# EAGLE design board (EAGLE 6.4)
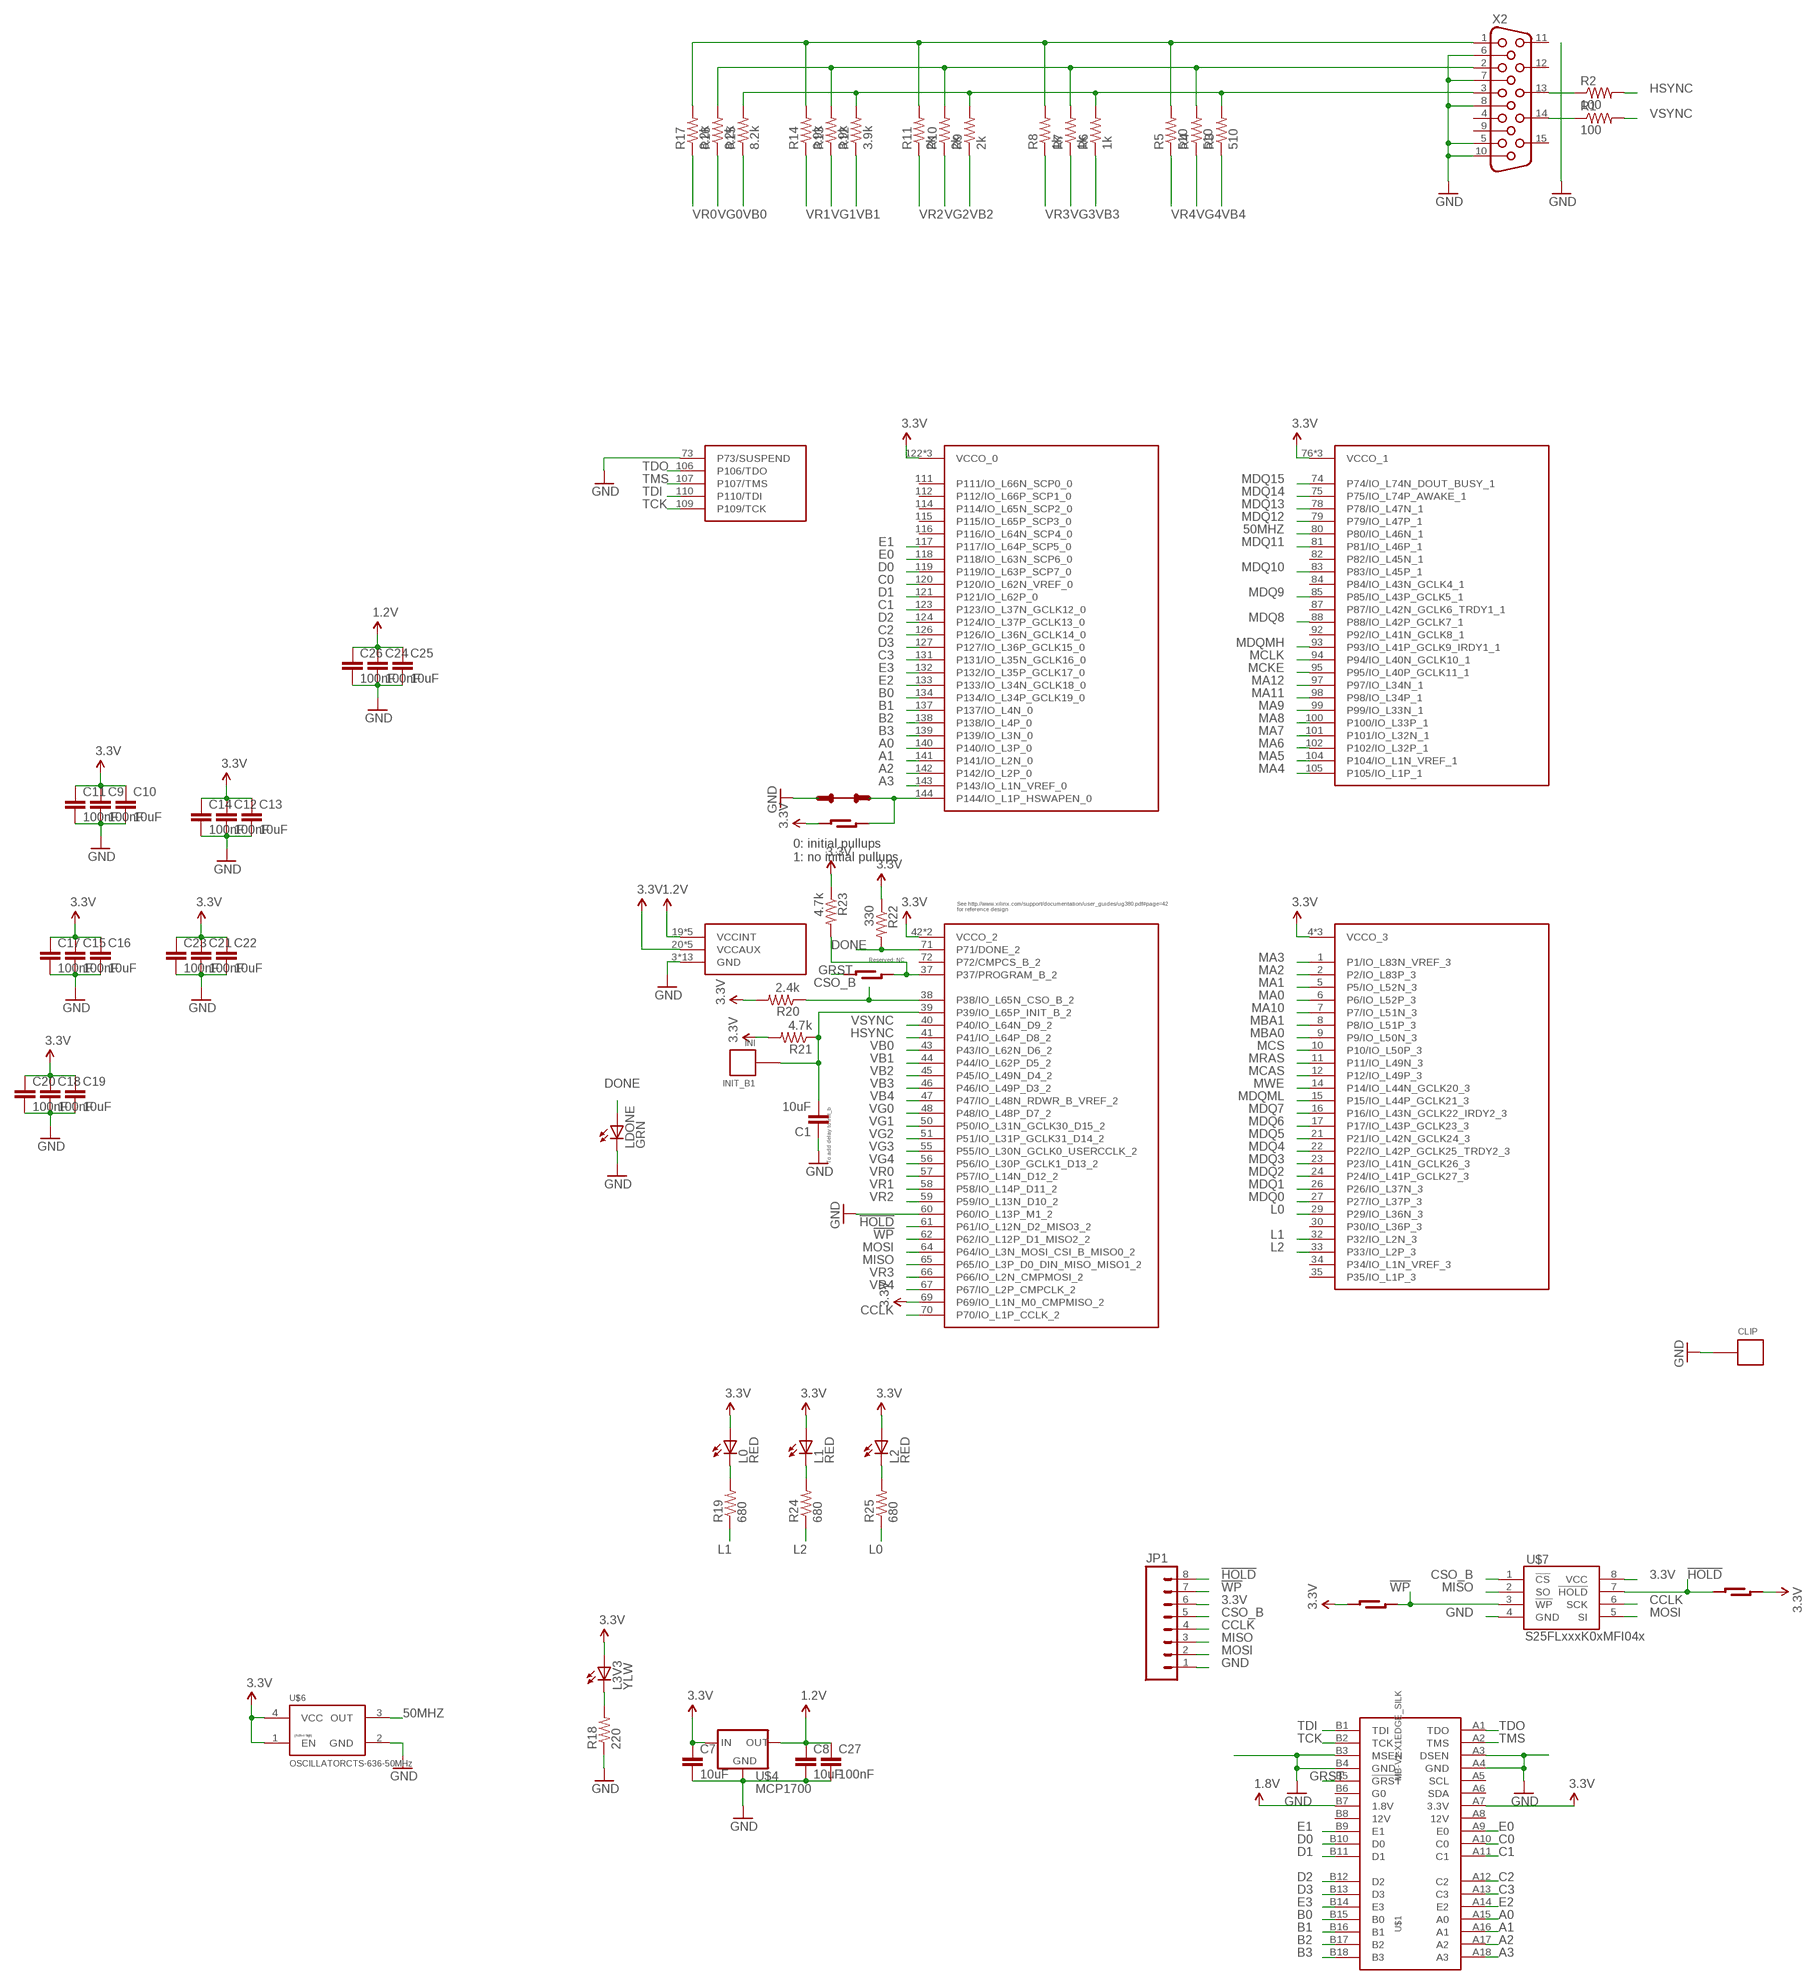
[diagram p0: schematic, sheet 1, part 1 of 2]
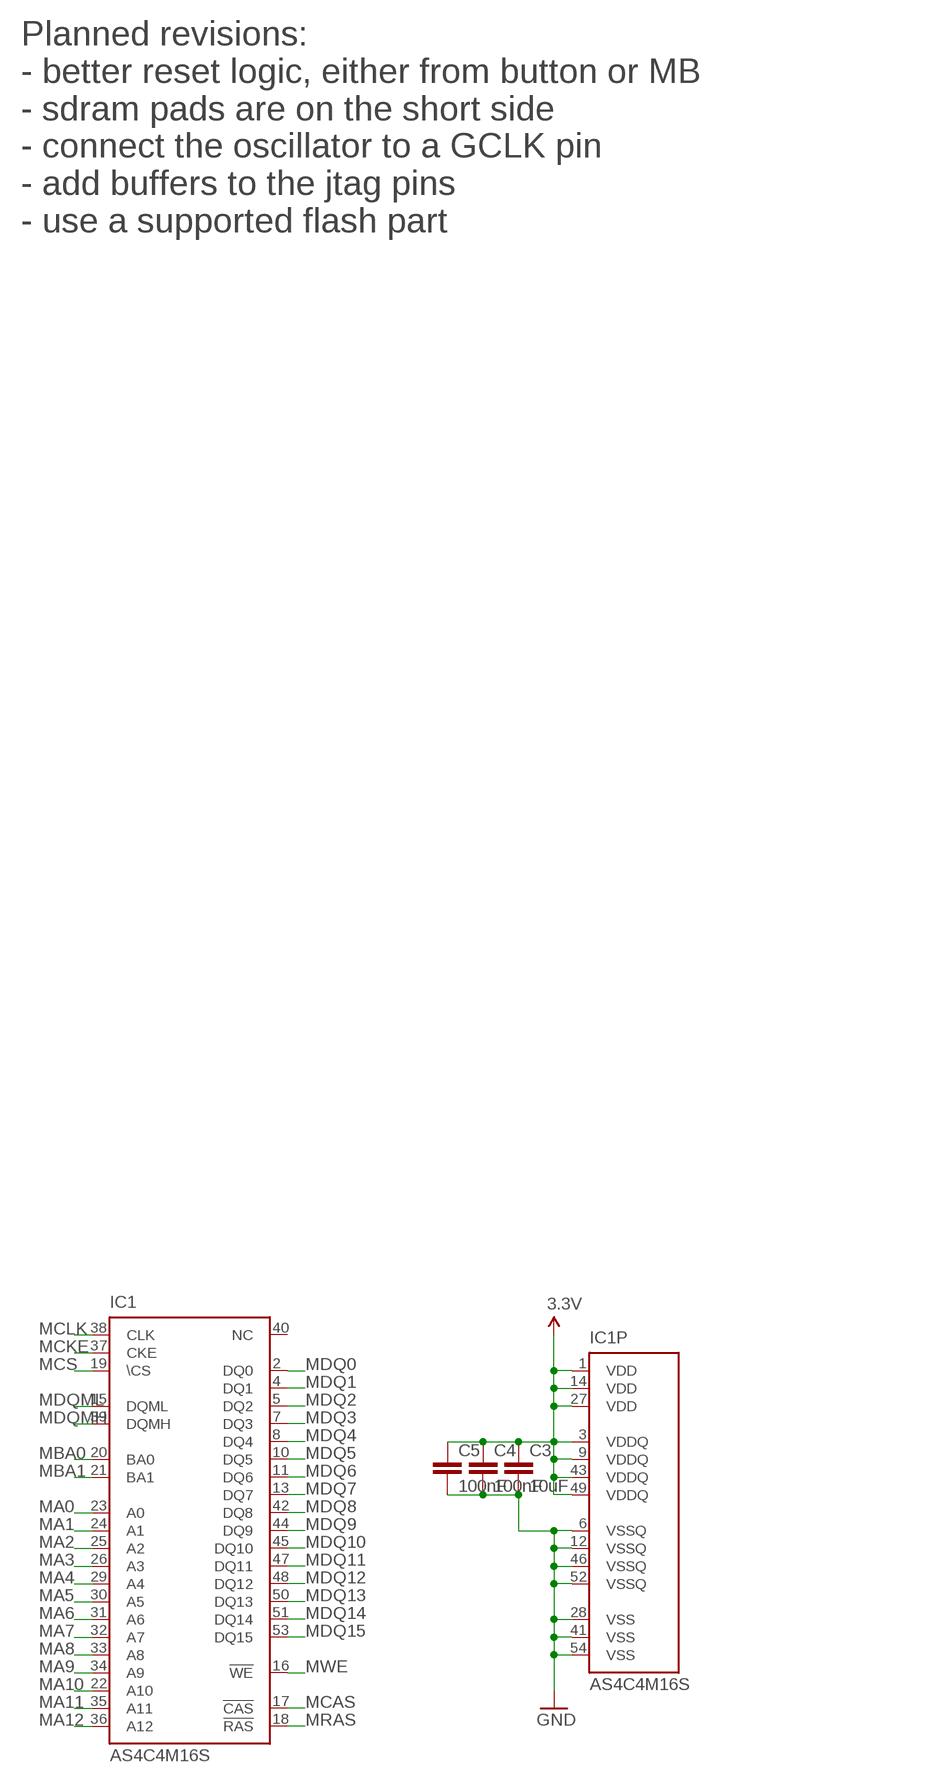
[diagram p1: schematic, sheet 1, part 2 of 2]

## Parts
C1  10uF  CAP0805  [0805]
C3  10uF  CAP0805  [0805]
C4  100nF  CAP0402-CAP  [0402-CAP]
C5  100nF  CAP0402-CAP  [0402-CAP]
C7  10uF  CAP0805  [0805]
C8  10uF  CAP0805  [0805]
C9  100nF  CAP0402-CAP  [0402-CAP]
C10  10uF  CAP0805  [0805]
C11  100nF  CAP0402-CAP  [0402-CAP]
C12  100nF  CAP0402-CAP  [0402-CAP]
C13  10uF  CAP0805  [0805]
C14  100nF  CAP0402-CAP  [0402-CAP]
C15  100nF  CAP0402-CAP  [0402-CAP]
C16  10uF  CAP0805  [0805]
C17  100nF  CAP0402-CAP  [0402-CAP]
C18  100nF  CAP0402-CAP  [0402-CAP]
C19  10uF  CAP0805  [0805]
C20  100nF  CAP0402-CAP  [0402-CAP]
C21  100nF  CAP0402-CAP  [0402-CAP]
C22  10uF  CAP0805  [0805]
C23  100nF  CAP0402-CAP  [0402-CAP]
C24  100nF  CAP0402-CAP  [0402-CAP]
C25  10uF  CAP0805  [0805]
C26  100nF  CAP0402-CAP  [0402-CAP]
C27  100nF  CAP0402-CAP  [0402-CAP]
CLIP  CONNECTORCLIP  [CLIP-AREA]
IC1  AS4C4M16S  MT48LC64M4A2  [TSOP54-400]
INIT_B1  INI  CONNECTOR1.27  [TESTPAD-1.27]
JP1  M08LOCK  [1X08_LOCK]
L0  RED  LED0603  [0603_LED]
L1  RED  LED0603  [0603_LED]
L2  RED  LED0603  [0603_LED]
L3V3  YLW  LED0603  [0603_LED]
LDONE  GRN  LED0603  [0603_LED]
R1  100  RESISTOR0603  [0603-RES]
R2  100  RESISTOR0603  [0603-RES]
R3  510  RESISTOR0603  [0603-RES]
R4  510  RESISTOR0603  [0603-RES]
R5  510  RESISTOR0603  [0603-RES]
R6  1k  RESISTOR0603  [0603-RES]
R7  1k  RESISTOR0603  [0603-RES]
R8  1k  RESISTOR0603  [0603-RES]
R9  2k  RESISTOR0603  [0603-RES]
R10  2k  RESISTOR0603  [0603-RES]
R11  2k  RESISTOR0603  [0603-RES]
R12  3.9k  RESISTOR0603  [0603-RES]
R13  3.9k  RESISTOR0603  [0603-RES]
R14  3.9k  RESISTOR0603  [0603-RES]
R15  8.2k  RESISTOR0603  [0603-RES]
R16  8.2k  RESISTOR0603  [0603-RES]
R17  8.2k  RESISTOR0603  [0603-RES]
R18  220  RESISTOR0603  [0603-RES]
R19  680  RESISTOR0603  [0603-RES]
R20  2.4k  RESISTOR0603  [0603-RES]
R21  4.7k  RESISTOR0603  [0603-RES]
R22  330  RESISTOR0603  [0603-RES]
R23  4.7k  RESISTOR0603  [0603-RES]
R24  680  RESISTOR0603  [0603-RES]
R25  680  RESISTOR0603  [0603-RES]
SB1  SOLDER-BRIDGEOPEN  [SOLDER-BRIDGE-OPEN]
SB2  TRACE-CUT  [TRACE-CUT]
SB3  SOLDER-BRIDGEOPEN  [SOLDER-BRIDGE-OPEN]
SB4  SOLDER-BRIDGEOPEN  [SOLDER-BRIDGE-OPEN]
SB5  SOLDER-BRIDGEOPEN  [SOLDER-BRIDGE-OPEN]
U$1  MB-V1-X1EDGE_SILK  [MB-V1-X1-EDGE]
U$4  MCP1700  VREGSOT23-3  [SOT23-3]
U$6  OSCILLATORCTS-636-50MHz  OSCILLATORCTS-636  [CTS-636]
U$7  S25FLxxxK0xMFI04x  S25FL  [SO08]
U$9  XC6SLX-TQ144  [XILINX_TQ144]
X2  HF15H  [HDF15H]

## Nets
1.2V: C8.1 C24.1 C25.1 C26.1 C27.1 U$4.2(OUT) U$9.19(VCCINT) U$9.28(VCCINT) U$9.52(VCCINT) U$9.89(VCCINT) U$9.128(VCCINT)
1.8V: U$1.B7(1.8V)
3.3V: C3.1 C4.1 C5.1 C7.1 C9.1 C10.1 C11.1 C12.1 C13.1 C14.1 C15.1 C16.1 C17.1 C18.1 C19.1 C20.1 C21.1 C22.1 C23.1 IC1.1(VDD) IC1.3(VDDQ) IC1.9(VDDQ) IC1.14(VDD) IC1.27(VDD) IC1.43(VDDQ) IC1.49(VDDQ) JP1.6 L0.A L1.A L2.A L3V3.A R20.2 R21.2 R22.1 R23.1 SB1.R1 SB1.R2 SB3.L1 SB3.L2 SB4.R1 SB4.R2 U$1.A7(3.3V) U$4.3(IN) U$6.1(EN) U$6.4(VCC) U$7.8(VCC) U$9.4(VCCO_3) U$9.18(VCCO_3) U$9.20(VCCAUX) U$9.31(VCCO_3) U$9.36(VCCAUX) U$9.42(VCCO_2) U$9.53(VCCAUX) U$9.63(VCCO_2) U$9.69(P69/IO_L1N_M0_CMPMISO_2) U$9.76(VCCO_1) U$9.86(VCCO_1) U$9.90(VCCAUX) U$9.103(VCCO_1) U$9.122(VCCO_0) U$9.125(VCCO_0) U$9.129(VCCAUX) U$9.135(VCCO_0)
50MHZ: U$6.3(OUT) U$9.80(P80/IO_L46N_1)
!HOLD: JP1.8 SB3.R1 SB3.R2 U$7.7(!HOLD) U$9.61(P61/IO_L12N_D2_MISO3_2)
!WP: JP1.7 SB4.L1 SB4.L2 U$7.3(!WP) U$9.62(P62/IO_L12P_D1_MISO2_2)
A0: U$1.A15(A0) U$9.140(P140/IO_L3P_0)
A1: U$1.A16(A1) U$9.141(P141/IO_L2N_0)
A2: U$1.A17(A2) U$9.142(P142/IO_L2P_0)
A3: U$1.A18(A3) U$9.143(P143/IO_L1N_VREF_0)
B0: U$1.B15(B0) U$9.134(P134/IO_L34P_GCLK19_0)
B1: U$1.B16(B1) U$9.137(P137/IO_L4N_0)
B2: U$1.B17(B2) U$9.138(P138/IO_L4P_0)
B3: U$1.B18(B3) U$9.139(P139/IO_L3N_0)
C0: U$1.A10(C0) U$9.120(P120/IO_L62N_VREF_0)
C1: U$1.A11(C1) U$9.123(P123/IO_L37N_GCLK12_0)
C2: U$1.A12(C2) U$9.126(P126/IO_L36N_GCLK14_0)
C3: U$1.A13(C3) U$9.131(P131/IO_L35N_GCLK16_0)
CCLK: JP1.4 U$7.6(SCK) U$9.70(P70/IO_L1P_CCLK_2)
CSO_B: JP1.5 R20.1 U$7.1(!CS) U$9.38(P38/IO_L65N_CSO_B_2)
D0: U$1.B10(D0) U$9.119(P119/IO_L63P_SCP7_0)
D1: U$1.B11(D1) U$9.121(P121/IO_L62P_0)
D2: U$1.B12(D2) U$9.124(P124/IO_L37P_GCLK13_0)
D3: U$1.B13(D3) U$9.127(P127/IO_L36P_GCLK15_0)
DONE: LDONE.A R22.2 U$9.71(P71/DONE_2)
E0: U$1.A9(E0) U$9.118(P118/IO_L63N_SCP6_0)
E1: U$1.B9(E1) U$9.117(P117/IO_L64P_SCP5_0)
E2: U$1.A14(E2) U$9.133(P133/IO_L34N_GCLK18_0)
E3: U$1.B14(E3) U$9.132(P132/IO_L35P_GCLK17_0)
GND: C1.1 C3.2 C4.2 C5.2 C7.2 C8.2 C9.2 C10.2 C11.2 C12.2 C13.2 C14.2 C15.2 C16.2 C17.2 C18.2 C19.2 C20.2 C21.2 C22.2 C23.2 C24.2 C25.2 C26.2 C27.2 CLIP.P$1(P) CLIP.P$2(P) IC1.6(VSSQ) IC1.12(VSSQ) IC1.28(VSS) IC1.41(VSS) IC1.46(VSSQ) IC1.52(VSSQ) IC1.54(VSS) JP1.1 LDONE.C R18.1 SB2.L1 U$1.A3(DSEN) U$1.A4(GND) U$1.B3(MSEN) U$1.B4(GND) U$4.1(GND) U$6.2(GND) U$7.4(GND) U$9.3(GND) U$9.13(GND) U$9.25(GND) U$9.49(GND) U$9.54(GND) U$9.60(P60/IO_L13P_M1_2) U$9.68(GND) U$9.73(P73/SUSPEND) U$9.77(GND) U$9.91(GND) U$9.96(GND) U$9.108(GND) U$9.113(GND) U$9.130(GND) U$9.136(GND) X2.5 X2.6 X2.7 X2.8 X2.10
GRST: SB5.L1 SB5.L2 U$1.B5(!GRST)
HSWAPEN: SB1.L1 SB1.L2 SB2.R1 U$9.144(P144/IO_L1P_HSWAPEN_0)
HSYNC: R2.2 U$9.41(P41/IO_L64P_D8_2)
INIT_B: C1.2 INIT_B1.P R21.1 U$9.39(P39/IO_L65P_INIT_B_2)
L0: R25.1 U$9.29(P29/IO_L36N_3)
L1: R19.1 U$9.32(P32/IO_L2N_3)
L2: R24.1 U$9.33(P33/IO_L2P_3)
MA0: IC1.23(A0) U$9.6(P6/IO_L52P_3)
MA1: IC1.24(A1) U$9.5(P5/IO_L52N_3)
MA2: IC1.25(A2) U$9.2(P2/IO_L83P_3)
MA3: IC1.26(A3) U$9.1(P1/IO_L83N_VREF_3)
MA4: IC1.29(A4) U$9.105(P105/IO_L1P_1)
MA5: IC1.30(A5) U$9.104(P104/IO_L1N_VREF_1)
MA6: IC1.31(A6) U$9.102(P102/IO_L32P_1)
MA7: IC1.32(A7) U$9.101(P101/IO_L32N_1)
MA8: IC1.33(A8) U$9.100(P100/IO_L33P_1)
MA9: IC1.34(A9) U$9.99(P99/IO_L33N_1)
MA10: IC1.22(A10) U$9.7(P7/IO_L51N_3)
MA11: IC1.35(A11) U$9.98(P98/IO_L34P_1)
MA12: IC1.36(A12) U$9.97(P97/IO_L34N_1)
MBA0: IC1.20(BA0) U$9.9(P9/IO_L50N_3)
MBA1: IC1.21(BA1) U$9.8(P8/IO_L51P_3)
MCAS: IC1.17(!CAS) U$9.12(P12/IO_L49P_3)
MCKE: IC1.37(CKE) U$9.95(P95/IO_L40P_GCLK11_1)
MCLK: IC1.38(CLK) U$9.94(P94/IO_L40N_GCLK10_1)
MCS: IC1.19(\CS) U$9.10(P10/IO_L50P_3)
MDQ0: IC1.2(DQ0) U$9.27(P27/IO_L37P_3)
MDQ1: IC1.4(DQ1) U$9.26(P26/IO_L37N_3)
MDQ2: IC1.5(DQ2) U$9.24(P24/IO_L41P_GCLK27_3)
MDQ3: IC1.7(DQ3) U$9.23(P23/IO_L41N_GCLK26_3)
MDQ4: IC1.8(DQ4) U$9.22(P22/IO_L42P_GCLK25_TRDY2_3)
MDQ5: IC1.10(DQ5) U$9.21(P21/IO_L42N_GCLK24_3)
MDQ6: IC1.11(DQ6) U$9.17(P17/IO_L43P_GCLK23_3)
MDQ7: IC1.13(DQ7) U$9.16(P16/IO_L43N_GCLK22_IRDY2_3)
MDQ8: IC1.42(DQ8) U$9.88(P88/IO_L42P_GCLK7_1)
MDQ9: IC1.44(DQ9) U$9.85(P85/IO_L43P_GCLK5_1)
MDQ10: IC1.45(DQ10) U$9.83(P83/IO_L45P_1)
MDQ11: IC1.47(DQ11) U$9.81(P81/IO_L46P_1)
MDQ12: IC1.48(DQ12) U$9.79(P79/IO_L47P_1)
MDQ13: IC1.50(DQ13) U$9.78(P78/IO_L47N_1)
MDQ14: IC1.51(DQ14) U$9.75(P75/IO_L74P_AWAKE_1)
MDQ15: IC1.53(DQ15) U$9.74(P74/IO_L74N_DOUT_BUSY_1)
MDQMH: IC1.39(DQMH) U$9.93(P93/IO_L41P_GCLK9_IRDY1_1)
MDQML: IC1.15(DQML) U$9.15(P15/IO_L44P_GCLK21_3)
MISO: JP1.3 U$7.2(SO) U$9.65(P65/IO_L3P_D0_DIN_MISO_MISO1_2)
MOSI: JP1.2 U$7.5(SI) U$9.64(P64/IO_L3N_MOSI_CSI_B_MISO0_2)
MRAS: IC1.18(!RAS) U$9.11(P11/IO_L49N_3)
MWE: IC1.16(!WE) U$9.14(P14/IO_L44N_GCLK20_3)
N$1: R1.1 X2.14
N$2: R2.1 X2.13
N$3: L0.C R19.2
N$4: L1.C R24.2
N$5: R3.2 R6.2 R9.2 R12.2 R15.2 X2.3
N$6: L3V3.C R18.2
N$7: R4.2 R7.2 R10.2 R13.2 R16.2 X2.2
N$8: R5.2 R8.2 R11.2 R14.2 R17.2 X2.1
N$9: L2.C R25.2
PROGRAM: R23.2 SB5.R1 SB5.R2 U$9.37(P37/PROGRAM_B_2)
TCK: U$1.B2(TCK) U$9.109(P109/TCK)
TDI: U$1.B1(TDI) U$9.110(P110/TDI)
TDO: U$1.A1(TDO) U$9.106(P106/TDO)
TMS: U$1.A2(TMS) U$9.107(P107/TMS)
VB0: R15.1 U$9.43(P43/IO_L62N_D6_2)
VB1: R12.1 U$9.44(P44/IO_L62P_D5_2)
VB2: R9.1 U$9.45(P45/IO_L49N_D4_2)
VB3: R6.1 U$9.46(P46/IO_L49P_D3_2)
VB4: R3.1 U$9.47(P47/IO_L48N_RDWR_B_VREF_2)
VG0: R16.1 U$9.48(P48/IO_L48P_D7_2)
VG1: R13.1 U$9.50(P50/IO_L31N_GCLK30_D15_2)
VG2: R10.1 U$9.51(P51/IO_L31P_GCLK31_D14_2)
VG3: R7.1 U$9.55(P55/IO_L30N_GCLK0_USERCCLK_2)
VG4: R4.1 U$9.56(P56/IO_L30P_GCLK1_D13_2)
VR0: R17.1 U$9.57(P57/IO_L14N_D12_2)
VR1: R14.1 U$9.58(P58/IO_L14P_D11_2)
VR2: R11.1 U$9.59(P59/IO_L13N_D10_2)
VR3: R8.1 U$9.66(P66/IO_L2N_CMPMOSI_2)
VR4: R5.1 U$9.67(P67/IO_L2P_CMPCLK_2)
VSYNC: R1.2 U$9.40(P40/IO_L64N_D9_2)
Unconnected: IC1.40(NC) U$1.A5(SCL) U$1.A6(SDA) U$1.A8(12V) U$1.B6(G0) U$1.B8(12V) U$9.30(P30/IO_L36P_3) U$9.34(P34/IO_L1N_VREF_3) U$9.35(P35/IO_L1P_3) U$9.72(P72/CMPCS_B_2) U$9.82(P82/IO_L45N_1) U$9.84(P84/IO_L43N_GCLK4_1) U$9.87(P87/IO_L42N_GCLK6_TRDY1_1) U$9.92(P92/IO_L41N_GCLK8_1) U$9.111(P111/IO_L66N_SCP0_0) U$9.112(P112/IO_L66P_SCP1_0) U$9.114(P114/IO_L65N_SCP2_0) U$9.115(P115/IO_L65P_SCP3_0) U$9.116(P116/IO_L64N_SCP4_0) X2.4 X2.9 X2.11 X2.12 X2.15

## Notes on the sheet
- 0: initial pullups
  1: no initial pullups
- Planned revisions:
  - better reset logic, either from button or MB
  - sdram pads are on the short side
  - connect the oscillator to a GCLK pin
  - add buffers to the jtag pins
  - use a supported flash part
- See http://www.xilinx.com/support/documentation/user_guides/ug380.pdf#page=42
  for reference design
- Reserved: NC
- To add delay to init_b

## Library data of the parts
C1 C3-C5 C7-C27 = kmod-passives:CAP: Capacitor Standard 0603 ceramic capacitor, and 0.1" leaded capacitor.
CLIP INIT_B1 = kmod-nonparts:CONNECTOR: Collection of holes/pads for testing/connecting
IC1 = memory-micron:MT48LC64M4A2: 256Mb: x16 SDRAM MT48LC64M4A2 - 16 Meg x 4 x 4 banks Source: http://download.micron.com/pdf/datasheets/dram/sdram/256MSDRAM.pdf; OC_FARNELL: unknown; OC_NEWARK: unknown
JP1 = SparkFun-Connectors:M08: Header 8 Standard 8-pin 0.1" header. Use with straight break away headers (SKU : PRT-00116), right angle break away headers (PRT-00553), swiss pins (PRT-00743), machine pins (PRT-00117), and female headers (PRT-00115).
L0 L1 L2 L3V3 LDONE = kmod-passives:LED
R1-R25 = kmod-passives:RESISTOR: Resistor Basic schematic elements and footprints for 0603, 1206, and PTH resistors.
SB1 SB3-SB5 = kmod-nonparts:SOLDER-BRIDGE
SB2 = kmod-nonparts:TRACE-CUT
U$1 = kmod-connectors:MB-V1-X1
U$4 = kmod-ics:VREG
U$6 = kmod-mechanical:OSCILLATOR
U$7 = kmod-ics:S25FL: Spansion S25FL* SPI flash
U$9 = kmod-xilinx:XC6SLX-TQ144: Spartan-6 in 144-TQFP package
X2 = con-subd:HF15: SUB-D; OC_FARNELL: unknown; OC_NEWARK: unknown

## Board
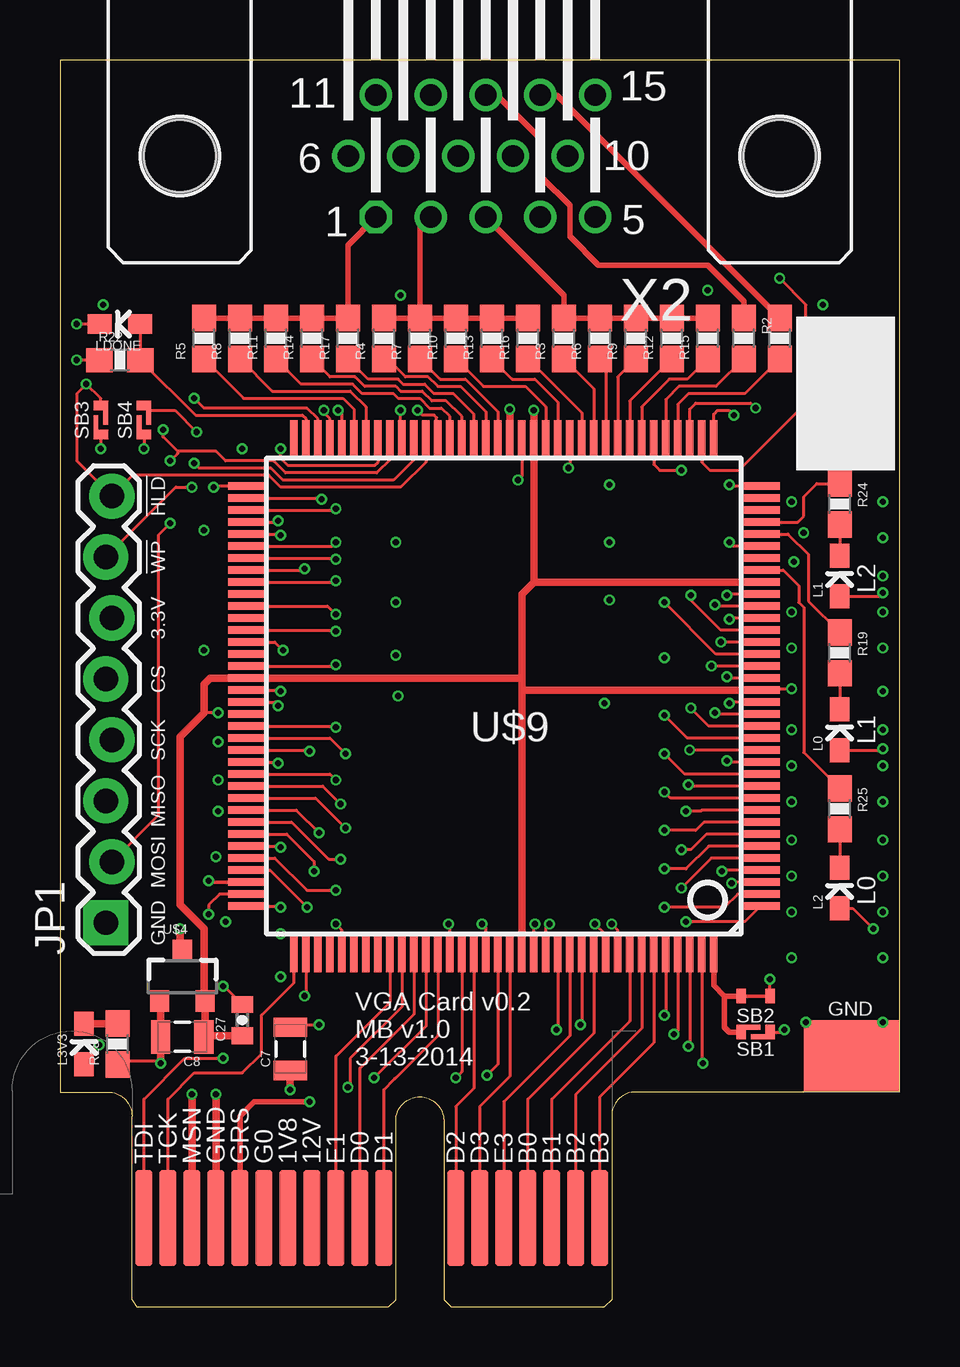
[diagram p2: board, top side]
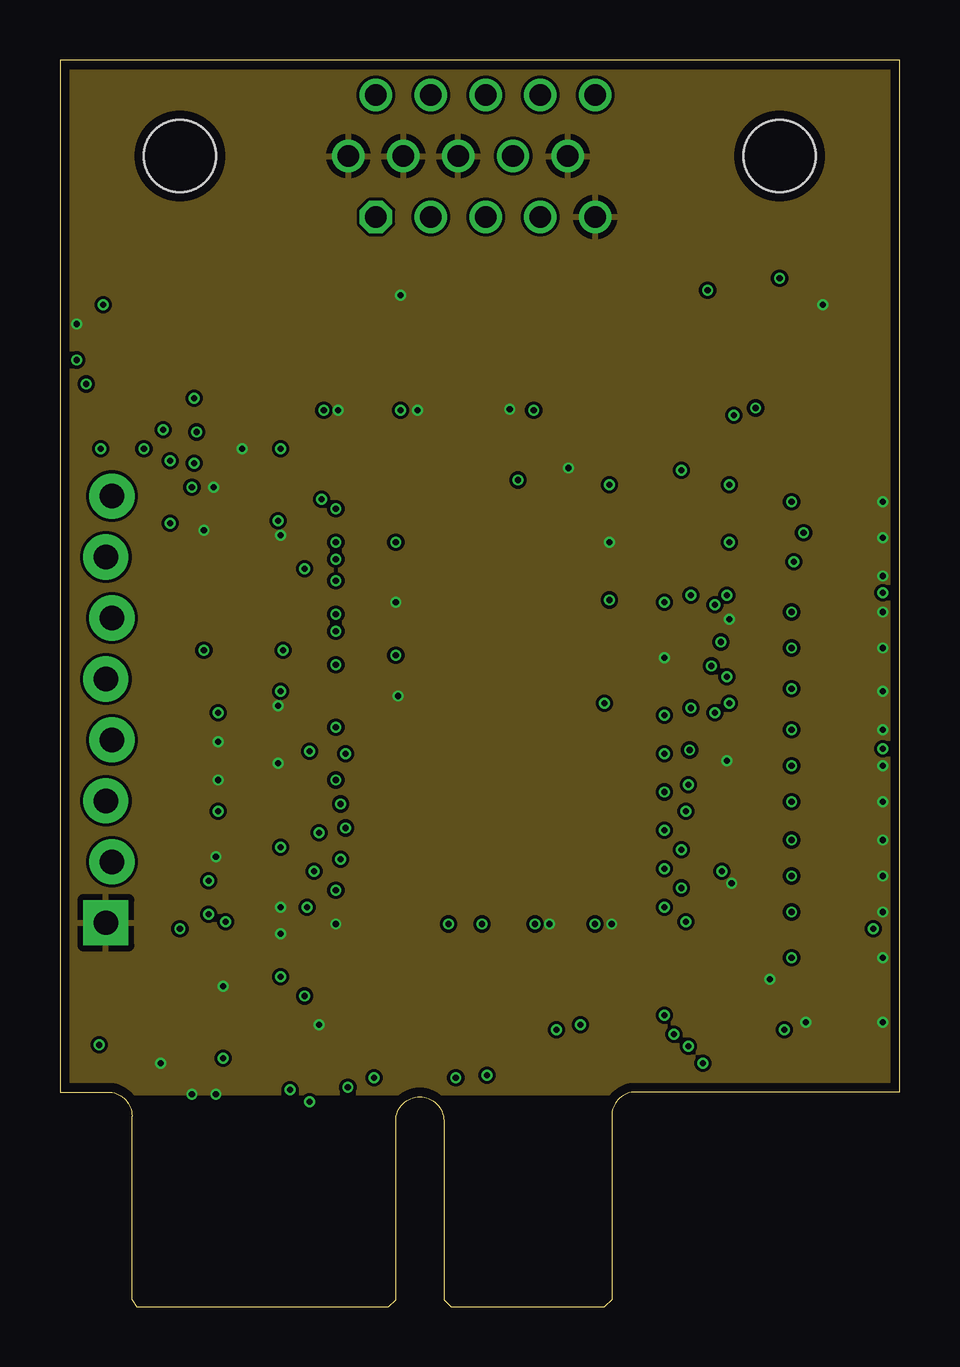
[diagram p3: board, inner layer Route2]
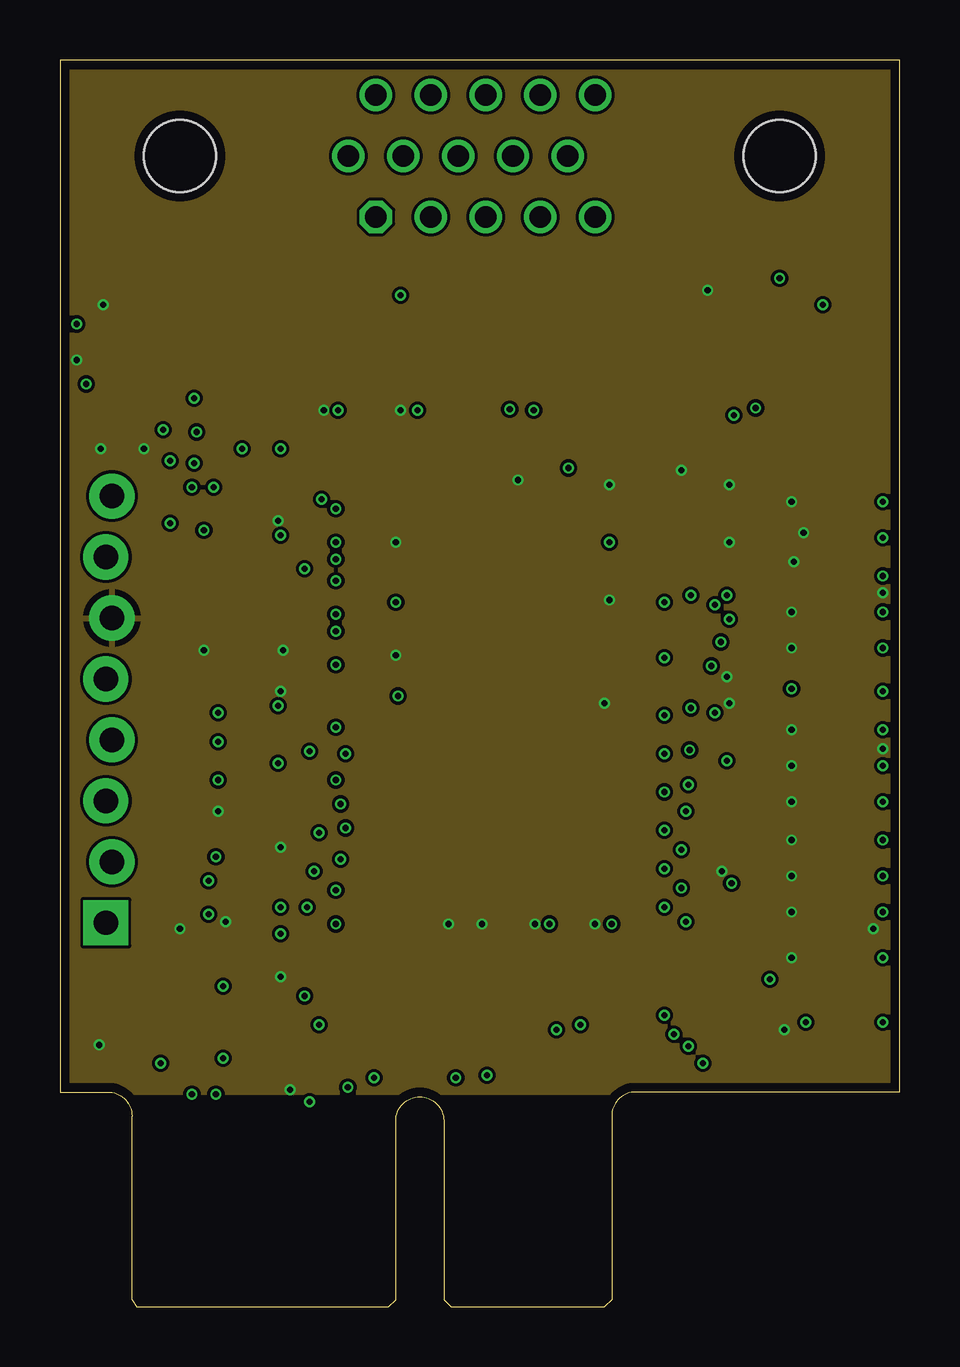
[diagram p4: board, inner layer Route15]
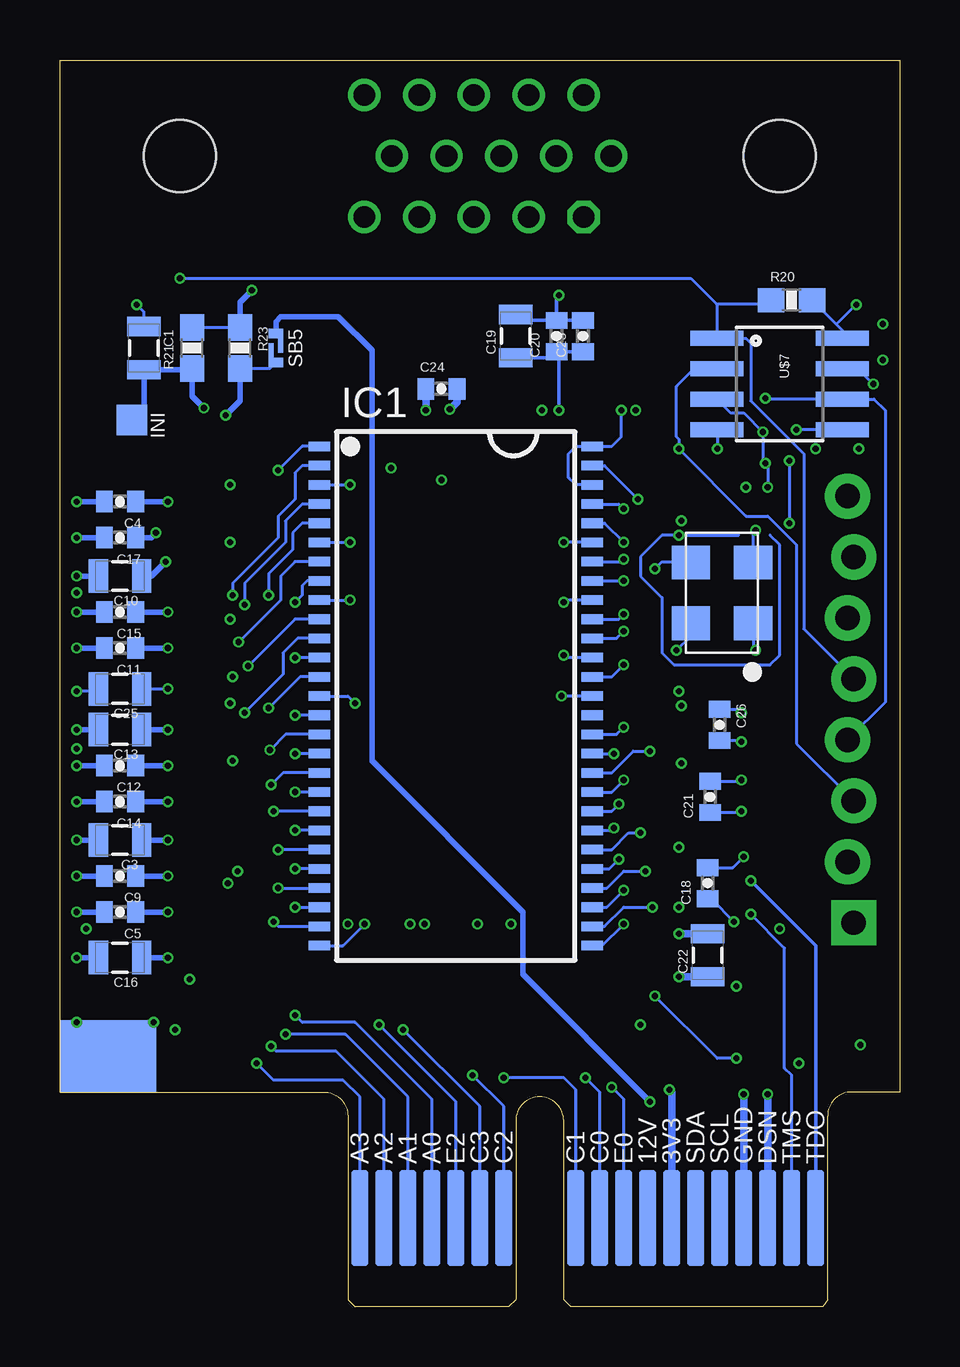
[diagram p5: board, bottom side, seen from below]

Size 35 x 51.95 mm. Coordinates in mm from the lower left corner, seen from the top.
Outline: 3,7.95 arc90 2,8.95 0,8.95 0,51.95 35,51.95 35,8.95 24,8.95 arc90 23,7.95
Copper layers (1+2*15+16): Top 0.0356mm / dielectric 0.17mm / Route2 0.0178mm / dielectric 1.1941mm / Route15 0.0178mm / dielectric 0.17mm / Bottom 0.0356mm
Design rules "OSHPark_mine_4layer *": minimum track width 5mil, minimum drill 10mil, track to track 5mil, track to pad 5mil, pad to pad 5mil, via to via 5mil, smd to smd 5mil, copper to edge 15mil, drill to drill 6mil, minimum pad ring 4mil, minimum via ring 4mil, stop-mask expansion 2mil, vias tented up to drill 13mil, thermal gap 10mil

### Footprints (pad centres in the part's own frame; a part is rotated, then mirrored left to right if it is on the bottom)
0805 = smd 0.8 x 1.4: 1 -0.9,0; 2 0.9,0
0402-CAP = smd 0.7 x 0.9: 1 -0.65,0; 2 0.65,0
CLIP-AREA = smd 4 x 3: P$1 0,0 | smd 4 x 3 bottom: P$2 0,0
TSOP54-400 = smd 0.4 x 0.9: 1 -10.4,-5.68; 2 -9.6,-5.68; 3 -8.8,-5.68; 4 -8,-5.68; 5 -7.2,-5.68; 6 -6.4,-5.68; 7 -5.6,-5.68; 8 -4.8,-5.68; 9 -4,-5.68; 10 -3.2,-5.68; 11 -2.4,-5.68; 12 -1.6,-5.68; 13 -0.8,-5.68; 14 0,-5.68; 15 0.8,-5.68; 16 1.6,-5.68; 17 2.4,-5.68; 18 3.2,-5.68; 19 4,-5.68; 20 4.8,-5.68; 21 5.6,-5.68; 22 6.4,-5.68; 23 7.2,-5.68; 24 8,-5.68; 25 8.8,-5.68; 26 9.6,-5.68; 27 10.4,-5.68; 28 10.4,5.68; 29 9.6,5.68; 30 8.8,5.68; 31 8,5.68; 32 7.2,5.68; 33 6.4,5.68; 34 5.6,5.68; 35 4.8,5.68; 36 4,5.68; 37 3.2,5.68; 38 2.4,5.68; 39 1.6,5.68; 40 0.8,5.68; 41 0,5.68; 42 -0.8,5.68; 43 -1.6,5.68; 44 -2.4,5.68; 45 -3.2,5.68; 46 -4,5.68; 47 -4.8,5.68; 48 -5.6,5.68; 49 -6.4,5.68; 50 -7.2,5.68; 51 -8,5.68; 52 -8.8,5.68; 53 -9.6,5.68; 54 -10.4,5.68
TESTPAD-1.27 = smd 1.27 x 1.27: P 0,0
1X08_LOCK = drill 1.016 pad 1.88 square: 1 0,0.127 | drill 1.016 pad 1.88: 2 2.54,-0.127; 3 5.08,0.127; 4 7.62,-0.127; 5 10.16,0.127; 6 12.7,-0.127; 7 15.24,0.127; 8 17.78,-0.127
0603_LED = smd 0.8 x 1.003: A 0,-0.852; C 0,0.852
0603-RES = smd 1.1 x 1: 1 -0.85,0; 2 0.85,0
SOLDER-BRIDGE-OPEN = smd 0.4 x 0.6: L1 -0.6,0; R1 0.6,0 | smd 0.6 x 0.2: L2 -0.1,0.2; R2 0.1,-0.2
TRACE-CUT = smd 0.4 x 0.6: L1 -0.6,0; R1 0.6,0
MB-V1-X1-EDGE = smd 0.7 x 4 bottom: A1 -11.5,-0.75; A2 -10.5,-0.75; A3 -9.5,-0.75; A4 -8.5,-0.75; A5 -7.5,-0.75; A6 -6.5,-0.75; A7 -5.5,-0.75; A8 -4.5,-0.75; A9 -3.5,-0.75; A10 -2.5,-0.75; A11 -1.5,-0.75; A12 1.5,-0.75; A13 2.5,-0.75; A14 3.5,-0.75; A15 4.5,-0.75; A16 5.5,-0.75; A17 6.5,-0.75; A18 7.5,-0.75 | smd 0.7 x 4: B1 -11.5,-0.75; B2 -10.5,-0.75; B3 -9.5,-0.75; B4 -8.5,-0.75; B5 -7.5,-0.75; B6 -6.5,-0.75; B7 -5.5,-0.75; B8 -4.5,-0.75; B9 -3.5,-0.75; B10 -2.5,-0.75; B11 -1.5,-0.75; B12 1.5,-0.75; B13 2.5,-0.75; B14 3.5,-0.75; B15 4.5,-0.75; B16 5.5,-0.75; B17 6.5,-0.75; B18 7.5,-0.75
SOT23-3 = smd 0.8 x 0.9: 1 -0.95,-1; 2 0.95,-1; 3 0,1.1
CTS-636 = smd 1.4 x 1.6: 1 -1.27,-1.3; 2 1.27,-1.3; 3 1.27,1.3; 4 -1.27,1.3
SO08 = smd 0.61 x 2.21: 1 -1.905,-2.616; 2 -0.635,-2.616; 3 0.635,-2.616; 4 1.905,-2.616; 5 1.905,2.616; 6 0.635,2.616; 7 -0.635,2.616; 8 -1.905,2.616
XILINX_TQ144 = smd 1.6 x 0.3: 1 -10.7,8.75; 2 -10.7,8.25; 3 -10.7,7.75; 4 -10.7,7.25; 5 -10.7,6.75; 6 -10.7,6.25; 7 -10.7,5.75; 8 -10.7,5.25; 9 -10.7,4.75; 10 -10.7,4.25; 11 -10.7,3.75; 12 -10.7,3.25; 13 -10.7,2.75; 14 -10.7,2.25; 15 -10.7,1.75; 16 -10.7,1.25; 17 -10.7,0.75; 18 -10.7,0.25; 19 -10.7,-0.25; 20 -10.7,-0.75; 21 -10.7,-1.25; 22 -10.7,-1.75; 23 -10.7,-2.25; 24 -10.7,-2.75; 25 -10.7,-3.25; 26 -10.7,-3.75; 27 -10.7,-4.25; 28 -10.7,-4.75; 29 -10.7,-5.25; 30 -10.7,-5.75; 31 -10.7,-6.25; 32 -10.7,-6.75; 33 -10.7,-7.25; 34 -10.7,-7.75; 35 -10.7,-8.25; 36 -10.7,-8.75; 73 10.7,-8.75; 74 10.7,-8.25; 75 10.7,-7.75; 76 10.7,-7.25; 77 10.7,-6.75; 78 10.7,-6.25; 79 10.7,-5.75; 80 10.7,-5.25; 81 10.7,-4.75; 82 10.7,-4.25; 83 10.7,-3.75; 84 10.7,-3.25; 85 10.7,-2.75; 86 10.7,-2.25; 87 10.7,-1.75; 88 10.7,-1.25; 89 10.7,-0.75; 90 10.7,-0.25; 91 10.7,0.25; 92 10.7,0.75; 93 10.7,1.25; 94 10.7,1.75; 95 10.7,2.25; 96 10.7,2.75; 97 10.7,3.25; 98 10.7,3.75; 99 10.7,4.25; 100 10.7,4.75; 101 10.7,5.25; 102 10.7,5.75; 103 10.7,6.25; 104 10.7,6.75; 105 10.7,7.25; 106 10.7,7.75; 107 10.7,8.25; 108 10.7,8.75 | smd 0.3 x 1.6: 37 -8.75,-10.7; 38 -8.25,-10.7; 39 -7.75,-10.7; 40 -7.25,-10.7; 41 -6.75,-10.7; 42 -6.25,-10.7; 43 -5.75,-10.7; 44 -5.25,-10.7; 45 -4.75,-10.7; 46 -4.25,-10.7; 47 -3.75,-10.7; 48 -3.25,-10.7; 49 -2.75,-10.7; 50 -2.25,-10.7; 51 -1.75,-10.7; 52 -1.25,-10.7; 53 -0.75,-10.7; 54 -0.25,-10.7; 55 0.25,-10.7; 56 0.75,-10.7; 57 1.25,-10.7; 58 1.75,-10.7; 59 2.25,-10.7; 60 2.75,-10.7; 61 3.25,-10.7; 62 3.75,-10.7; 63 4.25,-10.7; 64 4.75,-10.7; 65 5.25,-10.7; 66 5.75,-10.7; 67 6.25,-10.7; 68 6.75,-10.7; 69 7.25,-10.7; 70 7.75,-10.7; 71 8.25,-10.7; 72 8.75,-10.7; 109 8.75,10.7; 110 8.25,10.7; 111 7.75,10.7; 112 7.25,10.7; 113 6.75,10.7; 114 6.25,10.7; 115 5.75,10.7; 116 5.25,10.7; 117 4.75,10.7; 118 4.25,10.7; 119 3.75,10.7; 120 3.25,10.7; 121 2.75,10.7; 122 2.25,10.7; 123 1.75,10.7; 124 1.25,10.7; 125 0.75,10.7; 126 0.25,10.7; 127 -0.25,10.7; 128 -0.75,10.7; 129 -1.25,10.7; 130 -1.75,10.7; 131 -2.25,10.7; 132 -2.75,10.7; 133 -3.25,10.7; 134 -3.75,10.7; 135 -4.25,10.7; 136 -4.75,10.7; 137 -5.25,10.7; 138 -5.75,10.7; 139 -6.25,10.7; 140 -6.75,10.7; 141 -7.25,10.7; 142 -7.75,10.7; 143 -8.25,10.7; 144 -8.75,10.7
HDF15H = drill 0.9 octagon: 1 4.329,2.54 | drill 0.9: 2 2.043,2.54; 3 -0.243,2.54; 4 -2.529,2.54; 5 -4.815,2.54; 6 5.472,0; 7 3.186,0; 8 0.9,0; 9 -1.386,0; 10 -3.672,0; 11 4.329,-2.54; 12 2.043,-2.54; 13 -0.243,-2.54; 14 -2.529,-2.54; 15 -4.815,-2.54 | hole 3: -12.5,0; 12.5,0

### Placement (x,y rotation side)
C1  31.5,39.95 270 bottom
C3  32.5,19.45 180 bottom
C4  32.5,33.55 180 bottom
C5  32.5,16.45 180 bottom
C7  9.6,10.75 90 top
C8  5.1,11.25 180 top
C9  32.5,17.95 180 bottom
C10  32.5,30.45 180 bottom
C11  32.5,27.45 180 bottom
C12  32.5,22.55 180 bottom
C13  32.5,24.05 180 bottom
C14  32.5,21.05 180 bottom
C15  32.5,28.95 180 bottom
C16  32.5,14.55 180 bottom
C17  32.5,32.05 180 bottom
C18  8,17.65 90 bottom
C19  16,40.45 90 bottom
C20  14.3,40.45 90 bottom
C21  7.9,21.25 90 bottom
C22  8,14.65 90 bottom
C23  13.2,40.45 90 bottom
C24  19.1,38.25 0 bottom
C25  32.5,25.75 180 bottom
C26  7.5,24.25 270 bottom
C27  7.6,11.95 90 top
CLIP  33,10.45 0 top
IC1  18.5,25.45 270 bottom
INIT_B1  32,36.95 90 bottom
JP1  2.04,16 90 top
L0  32.5,24.05 0 top
L1  32.5,30.45 0 top
L2  32.5,17.45 0 top
L3V3  1,10.95 0 top
LDONE  2.5,40.95 90 top
R1  30,40.35 270 top
R2  28.5,40.35 270 top
R3  21,40.35 90 top
R4  13.5,40.35 90 top
R5  6,40.35 90 top
R6  22.5,40.35 90 top
R7  15,40.35 90 top
R8  7.5,40.35 90 top
R9  24,40.35 90 top
R10  16.5,40.35 90 top
R11  9,40.35 90 top
R12  25.5,40.35 90 top
R13  18,40.35 90 top
R14  10.5,40.35 90 top
R15  27,40.35 90 top
R16  19.5,40.35 90 top
R17  12,40.35 90 top
R18  2.4,10.95 90 top
R19  32.5,27.25 270 top
R20  4.5,41.95 0 bottom
R21  29.5,39.95 90 bottom
R22  2.5,39.45 0 top
R23  27.5,39.95 270 bottom
R24  32.5,33.45 270 top
R25  32.5,20.75 270 top
SB1  29,11.45 0 top
SB2  29,12.95 180 top
SB3  1.7,36.95 90 top
SB4  3.5,36.95 270 top
SB5  26,39.95 270 bottom
U$1  15,4.45 0 top
U$4  5.1,13.75 0 top
U$6  7.4,29.75 90 bottom
U$7  5,38.45 270 bottom
U$9  18.5,25.45 180 top
X2  17.5,47.95 180 top

### Tracks (layer width: path | path; a pad name or v marks a point on that pad's centre or on a via)
1.2V  (via drill 0.25)
  Top 0.127: 19.75,30.2 19.7,30.25 19.75,30.3 | 19.8,25.7 19.75,25.7 | U$9.19 29.25,25.75 v30.5,25.75 | v6.6,24.75 6,24.75
  Top 0.305: U$9.28 19.75,30.2 19.25,29.7 19.25,26.2 | 19.75,30.3 U$9.52 v19.75,37.35 | U$9.19 19.8,25.7 | 19.25,26.2 U$9.89 6.25,26.2 6,25.95 6,24.75 5,23.75 5,16.75 6,15.75 6,12.8 U$4.2 6.05,11.3 | U$9.128 19.25,25.65 | 19.25,26.2 19.25,25.65 | 19.75,25.7 19.3,25.7 19.25,25.65 | C8.1 6.05,11.3 | 6.05,11.3 C27.1
  Bottom 0.127: C25.1 v30.5,25.75 | C26.1 6.75,24.9 v6.6,24.75
  Bottom 0.305: C24.1 v19.75,37.35
3.3V  (via drill 0.25)
  Top 0.127: U$9.36 27.95,34.2 v27.9,34.25 | U$9.4 27.65,18.2 v27.6,18.15 | U$9.103 9.15,19.2 v9.2,19.15 | U$9.90 9.15,25.7 v9.2,25.65 | U$9.86 8.95,27.7 v9.3,27.35 | U$9.76 9.05,32.7 v9.1,32.75 | U$9.53 19.25,34.6 v19.1,34.45 | U$9.42 24.75,35.1 25,34.85 v25.9,34.85 | U$9.31 28.05,31.7 v27.9,31.85 | U$9.20 27.85,26.2 v27.8,26.25 | U$9.18 27.95,25.2 v27.9,25.15 | U$9.63 14.2,36.2 v14.2,37.35 | U$9.69 11.25,37 11,37.25 v11,37.35 | U$9.122 16.25,15.9 v16.2,15.95 | U$9.125 17.75,15.8 v17.6,15.95 | U$9.129 19.75,15.9 v19.8,15.95 | U$9.135 22.75,15.5 v22.3,15.95 | SB1.R2 29.4,11.25 SB1.R1 30.1,11.45 v30.2,11.55 | L1.A 34.15,29.6 v34.3,29.75 | R22.1 v0.7,39.45 | SB3.L2 1.5,36.55 SB3.L1 v1.7,35.75 | SB4.R2 3.3,36.55 SB4.R1 v3.5,35.75 | L3V3.A 1,10.27 v1.64,10.91 | L0.A 34.25,23.2 v34.3,23.25 | L2.A 33.05,16.6 v33.9,15.75
  Top 0.305: U$4.3 5,14.95 v5,15.75 | C7.1 v9.6,9.05
  Bottom 0.127: IC1.9 v22.9,29.45 | IC1.3 v22.9,34.25 | IC1.1 24.9,35.85 v25.9,34.85 | IC1.14 23,25.45 v22.7,25.15 | IC1.49 v14,31.85 | IC1.43 13.9,27.05 v14,27.15 | IC1.27 23.2,15.05 v22.3,15.95 | R20.2 2.63,40.93 | 2.63,40.93 2.38,40.68 U$7.8 | 2.63,40.93 1.81,41.75 v1.8,41.75 | U$6.4 8.7,27.95 v9.3,27.35 | U$6.1 6.1,27.45 v6,27.35 | C18.1 7.85,17 v6.9,16.05 | C21.1 6.65,20.6 v6.6,20.65 | R23.1 R21.2
  Bottom 0.152: C19.1 14.55,39.55 C20.1 | C20.1 C23.1 | v14.2,37.35 14.2,39.7 C20.1
  Bottom 0.229: C4.1 v30.5,33.55 | C16.1 v30.5,14.55 | C5.1 v30.5,16.45 | C9.1 v30.5,17.95 | C3.1 v30.5,19.45 | C14.1 v30.5,21.05 | C12.1 v30.5,22.55 | C13.1 v30.5,24.05 | C11.1 v30.5,27.45 | C15.1 v30.5,28.95 | R23.1 27.5,41.85 v27,42.35 | C10.1 31.2,30.45 v30.6,31.05 | C17.1 31.2,32.05 v31,32.25
  Bottom 0.305: C22.1 v9.2,13.75 | v9.6,9.05 9.5,8.95 U$1.A7
  pour Route15 (isolate 0.127): 0.1,51.65 35.1,51.65 35,8.95 0,8.95
50MHZ  (via drill 0.25)
  Top 0.127: U$9.80 10.15,30.7 v10.2,30.75
  Bottom 0.127: U$6.3 9.93,31.02 v10.2,30.75
!HOLD  (via drill 0.25)
  Top 0.127: U$9.61 15.25,35.2 14.2,34.15 9.2,34.15 8.7,34.65 3.04,34.65 JP1.8 0.7,35.25 0.7,38.05 v1.1,38.45 1.7,37.85 SB3.R1 1.9,37.35 SB3.R2
  Bottom 0.127: U$7.7 1.74,39.09 v1.1,38.45
!WP  (via drill 0.25)
  Top 0.127: U$9.62 14.75,35.3 13.9,34.45 9.3,34.45 8.8,34.95 5.8,34.95 v5.6,35.15 | SB4.L2 3.7,37.35 | 3.7,37.35 SB4.L1 | 3.7,37.35 4.8,37.35 v5.7,36.45 | JP1.7 4.82,34.15 v5.5,34.15
  Bottom 0.127: U$7.3 7.05,37.25 6.5,37.25 v5.7,36.45 5.7,35.25 v5.6,35.15 5.5,35.05 v5.5,34.15
A0  (via drill 0.25)
  Top 0.127: U$9.140 25.25,12.2 v25.2,12.15
  Bottom 0.127: U$1.A15 19.5,8.65 22.7,11.85 24.9,11.85 v25.2,12.15
A1  (via drill 0.25)
  Top 0.127: U$9.141 25.75,11.5 v25.6,11.35
  Bottom 0.127: U$1.A16 20.5,8.75 23.1,11.35 v25.6,11.35
A2  (via drill 0.25)
  Top 0.127: U$9.142 26.25,10.9 v26.2,10.85
  Bottom 0.127: U$1.A17 21.5,8.65 23.5,10.65 26,10.65 v26.2,10.85
A3  (via drill 0.25)
  Top 0.127: U$9.143 26.75,10.2 v26.8,10.15
  Bottom 0.127: U$1.A18 22.5,8.75 23.2,9.45 26.1,9.45 v26.8,10.15
B0
  Top 0.127: U$9.134 22.25,11.4 19.5,8.65 U$1.B15
B1
  Top 0.127: U$9.137 23.75,11.9 20.5,8.65 U$1.B16
B2
  Top 0.127: U$1.B17 21.5,8.85 24.25,11.6 U$9.138
B3
  Top 0.127: U$1.B18 22.5,8.75 24.75,11 U$9.139
C0  (via drill 0.25)
  Top 0.127: U$9.120 15.25,11.7 v13.1,9.55
  Bottom 0.127: U$1.A10 12.5,8.95 v13.1,9.55
C1  (via drill 0.25)
  Top 0.127: U$9.123 16.75,9.8 v16.5,9.55
  Bottom 0.127: U$1.A11 13.5,9.05 14,9.55 v16.5,9.55
C2  (via drill 0.25)
  Top 0.127: U$9.126 18.25,10.1 v17.8,9.65
  Bottom 0.127: U$1.A12 16.5,8.35 v17.8,9.65
C3  (via drill 0.25)
  Top 0.127: U$9.131 20.75,11.6 v20.7,11.55
  Bottom 0.127: U$1.A13 17.5,8.35 v20.7,11.55
CCLK  (via drill 0.25)
  Top 0.127: U$9.70 10.75,37 10.3,37.45 6,37.45 v5.6,37.85
  Bottom 0.127: v5.6,37.85 5.57,37.82 U$7.6 1.06,37.82 0.6,37.35 0.6,25.19 JP1.4
CSO_B  (via drill 0.25)
  Top 0.127: U$9.38 26.75,35.2 27.1,34.85 28.3,34.85 31.1,37.65 31.1,41.75 v30,42.85
  Bottom 0.127: v30,42.85 8.7,42.85 7.62,41.77 | 7.62,41.77 U$7.1 6.41,40.36 6.2,40.15 6.2,37.75 4,35.55 4,28.25 JP1.5 | R20.1 5.53,41.77 7.62,41.77
D0
  Top 0.127: U$1.B10 12.5,9.95 14.75,12.2 U$9.119
D1
  Top 0.127: U$1.B11 13.5,9.05 13.95,9.5 14,9.55 15.75,11.3 U$9.121
D2
  Top 0.127: U$9.124 17.25,9.1 16.5,8.35 U$1.B12
D3
  Top 0.127: U$1.B13 17.5,8.35 18.75,9.6 U$9.127
DONE
  Top 0.127: LDONE.A R22.2 5.65,37.15 10.1,37.15 10.25,37 U$9.71
E0  (via drill 0.25)
  Top 0.127: U$9.118 14.25,12.5 12.1,10.35 12.1,9.25 v12,9.15
  Bottom 0.127: U$1.A9 11.5,8.65 v12,9.15
E1
  Top 0.127: U$1.B9 11.5,10.45 13.75,12.7 U$9.117
E2  (via drill 0.25)
  Top 0.127: U$9.133 21.75,11.8 v21.7,11.75
  Bottom 0.127: U$1.A14 18.5,8.55 v21.7,11.75
E3
  Top 0.127: U$9.132 21.25,11.3 18.5,8.55 U$1.B14
GND  (via drill 0.25)
  Top 0.127: U$9.25 27.95,28.7 v27.9,28.65 | U$9.60 15.7,36.1 15.7,37.05 15.6,37.15 15.1,37.15 v14.9,37.35 | 11.7,36.1 U$9.68 11.75,37.2 v11.6,37.35 | U$9.49 21.25,35 v21.2,34.95 | U$9.13 27.85,22.7 v27.8,22.75 | U$9.3 28.05,17.7 v28,17.65 | U$9.136 23.25,15.7 v23,15.95 | U$9.130 20.25,15.8 v20.4,15.95 | U$9.113 11.75,15.7 v11.5,15.95 | U$9.108 9.15,16.7 v9.2,16.65 | U$9.96 9.05,22.7 v9.1,22.65 | U$9.91 8.95,25.2 v9.1,25.05 | U$9.73 6.45,34.2 v6.4,34.15 | U$9.77 9.15,32.2 v9.2,32.15 | SB2.L1 v29.6,13.65 | LDONE.C v0.7,40.95 | 2.55,10.25 4.1,10.25 v4.2,10.15 | C7.2 9.7,11.75 v10.8,11.75 | C27.2 6.85,13.35 v6.8,13.35 | CLIP.P$1 32.5,10.45 v31.1,11.85
  Top 0.305: U$9.54 v18.75,37.4 | U$1.A3 v5.5,8.85 | U$1.A4 v6.5,8.85 | U$4.1 4.2,12.7 C8.2 v4.2,10.15 | R18.1 2.55,10.25
  Bottom 0.127: IC1.12 v25.2,27.05 | IC1.6 v22.9,31.85 | IC1.28 12.4,15.05 v11.5,15.95 | IC1.52 13.5,34.25 13.8,34.55 13.8,35.55 13.5,35.85 IC1.54 12,35.85 11.6,36.25 v11.6,37.35 | IC1.41 v14.1,25.45 | IC1.46 13.9,29.45 v14,29.35 | C25.2 33.5,25.65 v34.3,25.65 | C1.1 31.5,41.45 v31.8,41.75 | U$7.4 7.6,36.54 v7.6,35.75 | U$6.2 6.1,32.25 v6,32.35 | C26.2 6.65,23.6 v6.6,23.55 | C21.2 6.65,21.9 v6.6,21.95 | C18.2 6.95,18.3 v6.5,18.75 | 5.4,32.15 5,31.75 5,27.15 5.4,26.75 9.4,26.75 9.9,27.25 9.9,29.55 10.8,30.45 10.8,31.25 9.9,32.15 v9.2,32.15 6.7,32.15 | v31.1,11.85 32.5,10.45 CLIP.P$1 34.3,11.75 v34.3,11.85
  Bottom 0.152: C23.2 C20.2 | C20.2 15.75,41.1 C19.2 | C20.2 14.3,42.05 v14.2,42.15
  Bottom 0.229: C17.2 v34.3,32.05 | C4.2 v34.3,33.55 | C16.2 v34.3,14.55 | C5.2 v34.3,16.45 | C9.2 v34.3,17.95 | C3.2 v34.3,19.45 | C14.2 v34.3,21.05 | C12.2 v34.3,22.55 | C13.2 v34.3,24.05 | C11.2 v34.3,27.45 | C15.2 v34.3,28.95 | C10.2 v34.3,30.45
  Bottom 0.305: C24.2 18.45,37.7 v18.75,37.4 | C22.2 v9.2,15.55 | U$1.A4 v6.5,8.85 | U$1.A3 v5.5,8.85
  pour Route2 (isolate 0.127): 0,8.95 35,8.95 35,51.95 0,51.95
GRST  (via drill 0.25)
  Top 0.229: U$1.B5 7.5,7.95 8.1,8.55 v10.4,8.55
  Bottom 0.127: SB5.L2 25.8,40.35 SB5.L1
  Bottom 0.229: SB5.L1 26,41.05 25.8,41.25 23.4,41.25 22,39.85 22,22.75 15.7,16.45 15.7,13.85 v10.4,8.55
HSWAPEN
  Top 0.127: SB1.L1 28.6,11.65 SB1.L2
  Top 0.229: U$9.144 27.25,13.4 27.7,12.95 | 27.7,12.95 SB2.R1 | 27.7,12.95 27.7,11.65 27.9,11.45 SB1.L1
HSYNC
  Top 0.127: R2.2 27.35,38.35 25.8,38.35 25.25,37.8 U$9.41
INIT_B  (via drill 0.25)
  Top 0.127: U$9.39 26.25,37.4 26.5,37.65 28.8,37.65 v29,37.45
  Bottom 0.127: 31.5,37.45 INIT_B1.P | 29.55,39.05 R21.1
  Bottom 0.229: 31.5,37.45 C1.2 29.55,39.05 | R21.1 29.5,37.95 v29,37.45
L0
  Top 0.127: U$9.29 30.15,30.7 30.8,30.05 30.8,29.35 31,29.15 31,23.1 R25.1
L1
  Top 0.127: U$9.32 30.35,32.2 31.2,31.35 31.2,29.4 R19.1
L2
  Top 0.127: U$9.33 30.75,32.7 31,32.95 31,33.75 31.55,34.3 R24.1
MA0  (via drill 0.25)
  Top 0.127: U$9.6 27.05,19.2 26.1,18.25 v25.2,18.25
  Bottom 0.127: IC1.23 v25.2,18.25
MA1  (via drill 0.25)
  Top 0.127: U$9.5 27.15,18.7 v25.9,17.45
  Bottom 0.127: v25.9,17.45 IC1.24
MA2  (via drill 0.25)
  Top 0.127: U$9.2 28.25,17.2 27.7,16.65 v25.2,16.65
  Bottom 0.127: v25.2,16.65 IC1.25
MA3  (via drill 0.25)
  Top 0.127: U$9.1 28.55,16.05 v26.1,16.05
  Bottom 0.127: v26.1,16.05 25.9,15.85 IC1.26
MA4  (via drill 0.25)
  Top 0.127: U$9.105 8.75,18.2 v10.3,16.65
  Bottom 0.127: IC1.29 12.3,15.85 11.5,16.65 v10.3,16.65
MA5  (via drill 0.25)
  Top 0.127: U$9.104 8.95,18.7 10.3,17.35 v11.5,17.35
  Bottom 0.127: IC1.30 12.2,16.65 v11.5,17.35
MA6  (via drill 0.25)
  Top 0.127: U$9.102 9.45,19.7 10.6,18.55 v10.6,18.15
  Bottom 0.127: IC1.31 12.2,17.45 11.5,18.15 v10.6,18.15
MA7  (via drill 0.25)
  Top 0.127: v11.7,18.65 11.2,18.65 9.65,20.2 U$9.101
  Bottom 0.127: IC1.32 12.1,18.25 v11.7,18.65
MA8  (via drill 0.25)
  Top 0.127: U$9.100 9.85,20.7 v10.8,19.75
  Bottom 0.127: IC1.33 12,19.05 11.3,19.75 v10.8,19.75
MA9  (via drill 0.25)
  Top 0.127: U$9.99 10.65,21.2 v11.9,19.95
  Bottom 0.127: IC1.34 12,19.85 v11.9,19.95
MA10  (via drill 0.25)
  Top 0.127: U$9.7 26.95,19.7 26.3,19.05 v25.9,19.05
  Bottom 0.127: IC1.22 v25.9,19.05
MA11  (via drill 0.25)
  Top 0.127: U$9.98 10.95,21.7 v11.7,20.95
  Bottom 0.127: IC1.35 12,20.65 v11.7,20.95
MA12  (via drill 0.25)
  Top 0.127: U$9.97 11.25,22.2 v11.5,21.95
  Bottom 0.127: IC1.36 12,21.45 v11.5,21.95
MBA0  (via drill 0.25)
  Top 0.127: U$9.9 26.75,20.7 26.7,20.65 v26.1,20.65
  Bottom 0.127: IC1.20 v26.1,20.65
MBA1  (via drill 0.25)
  Top 0.127: U$9.8 26.85,20.2 26.5,19.85 v25.2,19.85
  Bottom 0.127: IC1.21 v25.2,19.85
MCAS  (via drill 0.25)
  Top 0.127: U$9.12 26.05,22.2 v25.2,23.05
  Bottom 0.127: IC1.17 v25.2,23.05
MCKE  (via drill 0.25)
  Top 0.127: U$9.95 10.35,23.2 v10.4,23.15
  Bottom 0.127: IC1.37 12,22.25 11.1,23.15 v10.4,23.15
MCLK  (via drill 0.25)
  Top 0.127: U$9.94 11.25,23.7 v11.9,23.05
  Bottom 0.127: IC1.38 v11.9,23.05
MCS  (via drill 0.25)
  Top 0.127: U$9.10 25.45,21.2 v25.2,21.45
  Bottom 0.127: IC1.19 v25.2,21.45
MDQ0  (via drill 0.25)
  Top 0.127: U$9.27 27.85,29.7 v27.8,29.65
  Bottom 0.127: IC1.2 24.9,35.05 25.2,34.75 25.2,33.65 25.9,32.95 25.9,32.05 27.8,30.15 v27.8,29.65
MDQ1  (via drill 0.25)
  Top 0.127: U$9.26 27.35,29.2 v27.3,29.25
  Bottom 0.127: IC1.4 24.9,33.45 25.6,32.75 25.6,31.85 27.3,30.15 v27.3,29.25
MDQ2  (via drill 0.25)
  Top 0.127: U$9.24 27.55,28.2 26.3,29.45 v26.3,29.65
  Bottom 0.127: IC1.5 24.9,32.65 25.3,32.25 25.3,31.55 26.3,30.55 v26.3,29.65
MDQ3  (via drill 0.25)
  Top 0.127: U$9.23 v27.55,27.7
  Bottom 0.127: IC1.7 25.2,31.05 25.8,30.45 25.8,29.45 v27.55,27.7
MDQ4  (via drill 0.25)
  Top 0.127: U$9.22 27.35,27.2 v25.2,29.35
  Bottom 0.127: v25.2,29.35 24.9,29.65 24.9,30.05 24.7,30.25 IC1.8
MDQ5  (via drill 0.25)
  Top 0.127: U$9.21 v27.15,26.7
  Bottom 0.127: IC1.10 25.2,28.65 v27.15,26.7
MDQ6  (via drill 0.25)
  Top 0.127: U$9.17 27.35,24.7 v27.3,24.75
  Bottom 0.127: IC1.11 25.1,27.85 25.7,27.25 25.7,26.35 v27.3,24.75
MDQ7  (via drill 0.25)
  Top 0.127: U$9.16 27.05,24.2 v26.3,24.95
  Bottom 0.127: IC1.13 25,26.25 v26.3,24.95
MDQ8  (via drill 0.25)
  Top 0.127: U$9.88 11.45,26.7 v11.5,26.75
  Bottom 0.127: IC1.42 12,26.25 v11.5,26.75
MDQ9  (via drill 0.25)
  Top 0.127: U$9.85 11.45,28.2 v11.5,28.15
  Bottom 0.127: IC1.44 11.8,27.85 v11.5,28.15
MDQ10  (via drill 0.25)
  Top 0.127: U$9.83 11.15,29.2 v11.5,28.85
  Bottom 0.127: IC1.45 11.7,28.65 v11.5,28.85
MDQ11  (via drill 0.25)
  Top 0.127: U$9.81 11.45,30.2 v11.5,30.25
  Bottom 0.127: IC1.47 v11.5,30.25
MDQ12  (via drill 0.25)
  Top 0.127: U$9.79 11.45,31.2 v11.5,31.15
  Bottom 0.127: IC1.48 11.6,31.05 v11.5,31.15
MDQ13  (via drill 0.25)
  Top 0.127: U$9.78 11.35,31.7 v11.5,31.85
  Bottom 0.127: IC1.50 12.3,32.65 v11.5,31.85
MDQ14  (via drill 0.25)
  Top 0.127: U$9.75 11.45,33.2 v11.5,33.25
  Bottom 0.127: IC1.51 11.7,33.45 v11.5,33.25
MDQ15  (via drill 0.25)
  Top 0.127: U$9.74 10.85,33.7 v10.9,33.65
  Bottom 0.127: IC1.53 12.3,35.05 v10.9,33.65
MDQMH  (via drill 0.25)
  Top 0.127: U$9.93 11.45,24.2 v11.5,24.15
  Bottom 0.127: IC1.39 11.8,23.85 v11.5,24.15
MDQML  (via drill 0.25)
  Top 0.127: U$9.15 26.15,23.7 v25.2,24.65
  Bottom 0.127: IC1.15 v25.2,24.65
MISO  (via drill 0.25)
  Top 0.127: U$9.65 13.25,35.2 13.1,35.05 9.5,35.05 9.2,35.35 v9.2,35.75
  Bottom 0.127: U$7.2 8.56,39.09 9.3,38.35 9.3,36.25 9.2,36.15 v9.2,35.75 6.4,32.95 5.5,32.95 4.3,31.75 4.3,23.47 JP1.3
MOSI  (via drill 0.25)
  Top 0.127: U$9.64 13.75,35.3 13.2,34.75 9.4,34.75 8.9,35.25 6.9,35.25 6.5,35.65 4.9,35.65 | 4.9,35.65 4.3,36.25 v4.3,36.55 | 4.9,35.65 4.9,35.55 v4.6,35.25 | v4.6,32.65 4.1,32.15 4.1,20.47 JP1.2
  Bottom 0.127: U$7.5 v4.3,36.55 | v4.6,35.25 v4.6,32.65
MRAS  (via drill 0.25)
  Top 0.127: U$9.11 26.25,21.7 v26.2,21.75
  Bottom 0.127: IC1.18 25.7,22.25 v26.2,21.75
MWE  (via drill 0.25)
  Top 0.127: U$9.14 v26.25,23.2
  Bottom 0.127: IC1.16 25.6,23.85 v26.25,23.2
N$1
  Top 0.229: X2.14 20.71,50.49 R1.1
N$2
  Top 0.229: R2.1 28.5,41.9 27,43.4 22.45,43.4 21.25,44.6 21.25,45.9 20.1,47.05 20.1,48.6 18.21,50.49 X2.13
N$3
  Top 0.127: R19.2 L0.C
N$4
  Top 0.127: R24.2 L1.C
N$5
  Top 0.229: R15.2 R12.2 R9.2 R6.2 R3.2 21,42.15 X2.3
N$6
  Top 0.305: L3V3.C R18.2
N$7
  Top 0.229: R4.2 R7.2 | R7.2 R10.2 R13.2 R16.2 | R7.2 15,44.95 X2.2
N$8
  Top 0.229: R5.2 R8.2 R11.2 R14.2 R17.2 12,44.24 X2.1
N$9
  Top 0.127: R25.2 L2.C
PROGRAM  (via drill 0.25)
  Top 0.127: U$9.37 27.25,37.2 27.4,37.35 27.9,37.35 v28.1,37.15
  Bottom 0.127: R23.2 26.25,39.1 SB5.R1 26.2,39.55 SB5.R2
  Bottom 0.229: R23.2 27.5,37.75 v28.1,37.15
TCK
  Top 0.127: U$1.B2 4.5,8.65 5.6,9.75 7.6,9.75 8.4,10.55 8.4,12.15 9.75,13.5 U$9.109
TDI  (via drill 0.25)
  Top 0.127: U$1.B1 3.5,8.65 5.2,10.35 v6.8,10.35 | U$9.110 10.25,13 v10.2,12.95
  Bottom 0.127: v6.8,10.35 7.6,10.35 v10.2,12.95
TDO  (via drill 0.25)
  Top 0.152: U$9.106 6.25,17.7 v6.2,17.75
  Bottom 0.152: U$1.A1 3.5,15.05 v6.2,17.75
TMS  (via drill 0.25)
  Top 0.127: U$9.107 6.65,17.2 6.2,16.75 v6.2,16.35
  Bottom 0.127: U$1.A2 4.5,9.65 4.8,9.95 4.8,14.95 v6.2,16.35
VB0
  Top 0.127: R15.1 26.15,38.65 25.4,38.65 24.25,37.5 U$9.43
VB1
  Top 0.127: R12.1 23.75,37.75 U$9.44
VB2
  Top 0.127: R9.1 23.25,38.75 U$9.45
VB3
  Top 0.127: R6.1 22.75,39.25 U$9.46
VB4
  Top 0.127: R3.1 22.25,38.25 U$9.47
VG0
  Top 0.127: R16.1 21.75,37.25 U$9.48
VG1
  Top 0.127: R13.1 18.85,38.65 19.8,38.65 20.75,37.7 U$9.50
VG2
  Top 0.127: R10.1 17.65,38.35 19.4,38.35 20.25,37.5 U$9.51
VG3
  Top 0.127: R7.1 15.85,38.65 16.9,38.65 18.25,37.3 U$9.55
VG4
  Top 0.127: U$9.56 17.75,37.3 16.7,38.35 15.75,38.35 15.35,38.75 14.4,38.75 13.65,39.5 R4.1
VR0
  Top 0.127: U$9.57 17.25,37.2 16.4,38.05 15.6,38.05 15.2,38.45 14.3,38.45 14.1,38.65 12.85,38.65 R17.1
VR1
  Top 0.127: U$9.58 16.75,37.1 16.1,37.75 15.5,37.75 15.1,38.15 14.2,38.15 14,38.35 12.7,38.35 12.3,38.75 11.25,38.75 R14.1
VR2
  Top 0.127: U$9.59 16.25,37.1 15.9,37.45 15.4,37.45 15,37.85 14.1,37.85 13.9,38.05 12.6,38.05 12.2,38.45 10.05,38.45 R11.1
VR3
  Top 0.127: R8.1 8.85,38.15 12.1,38.15 12.75,37.5 U$9.66
VR4
  Top 0.127: R5.1 7.65,37.85 11.8,37.85 12.25,37.4 U$9.67
VSYNC
  Top 0.127: R1.2 28.55,38.05 26.2,38.05 25.75,37.6 U$9.40

### Text on the board
tPlace: !HLD | !WP | L2 | 3.3V | CS | SCK | L1 | MISO | MOSI | L0 | GND | GND | VGA Card v0.2 / MB v1.0 / 3-13-2014